# EAGLE design Horn_board_v2.2 (EAGLE 9.6.2)
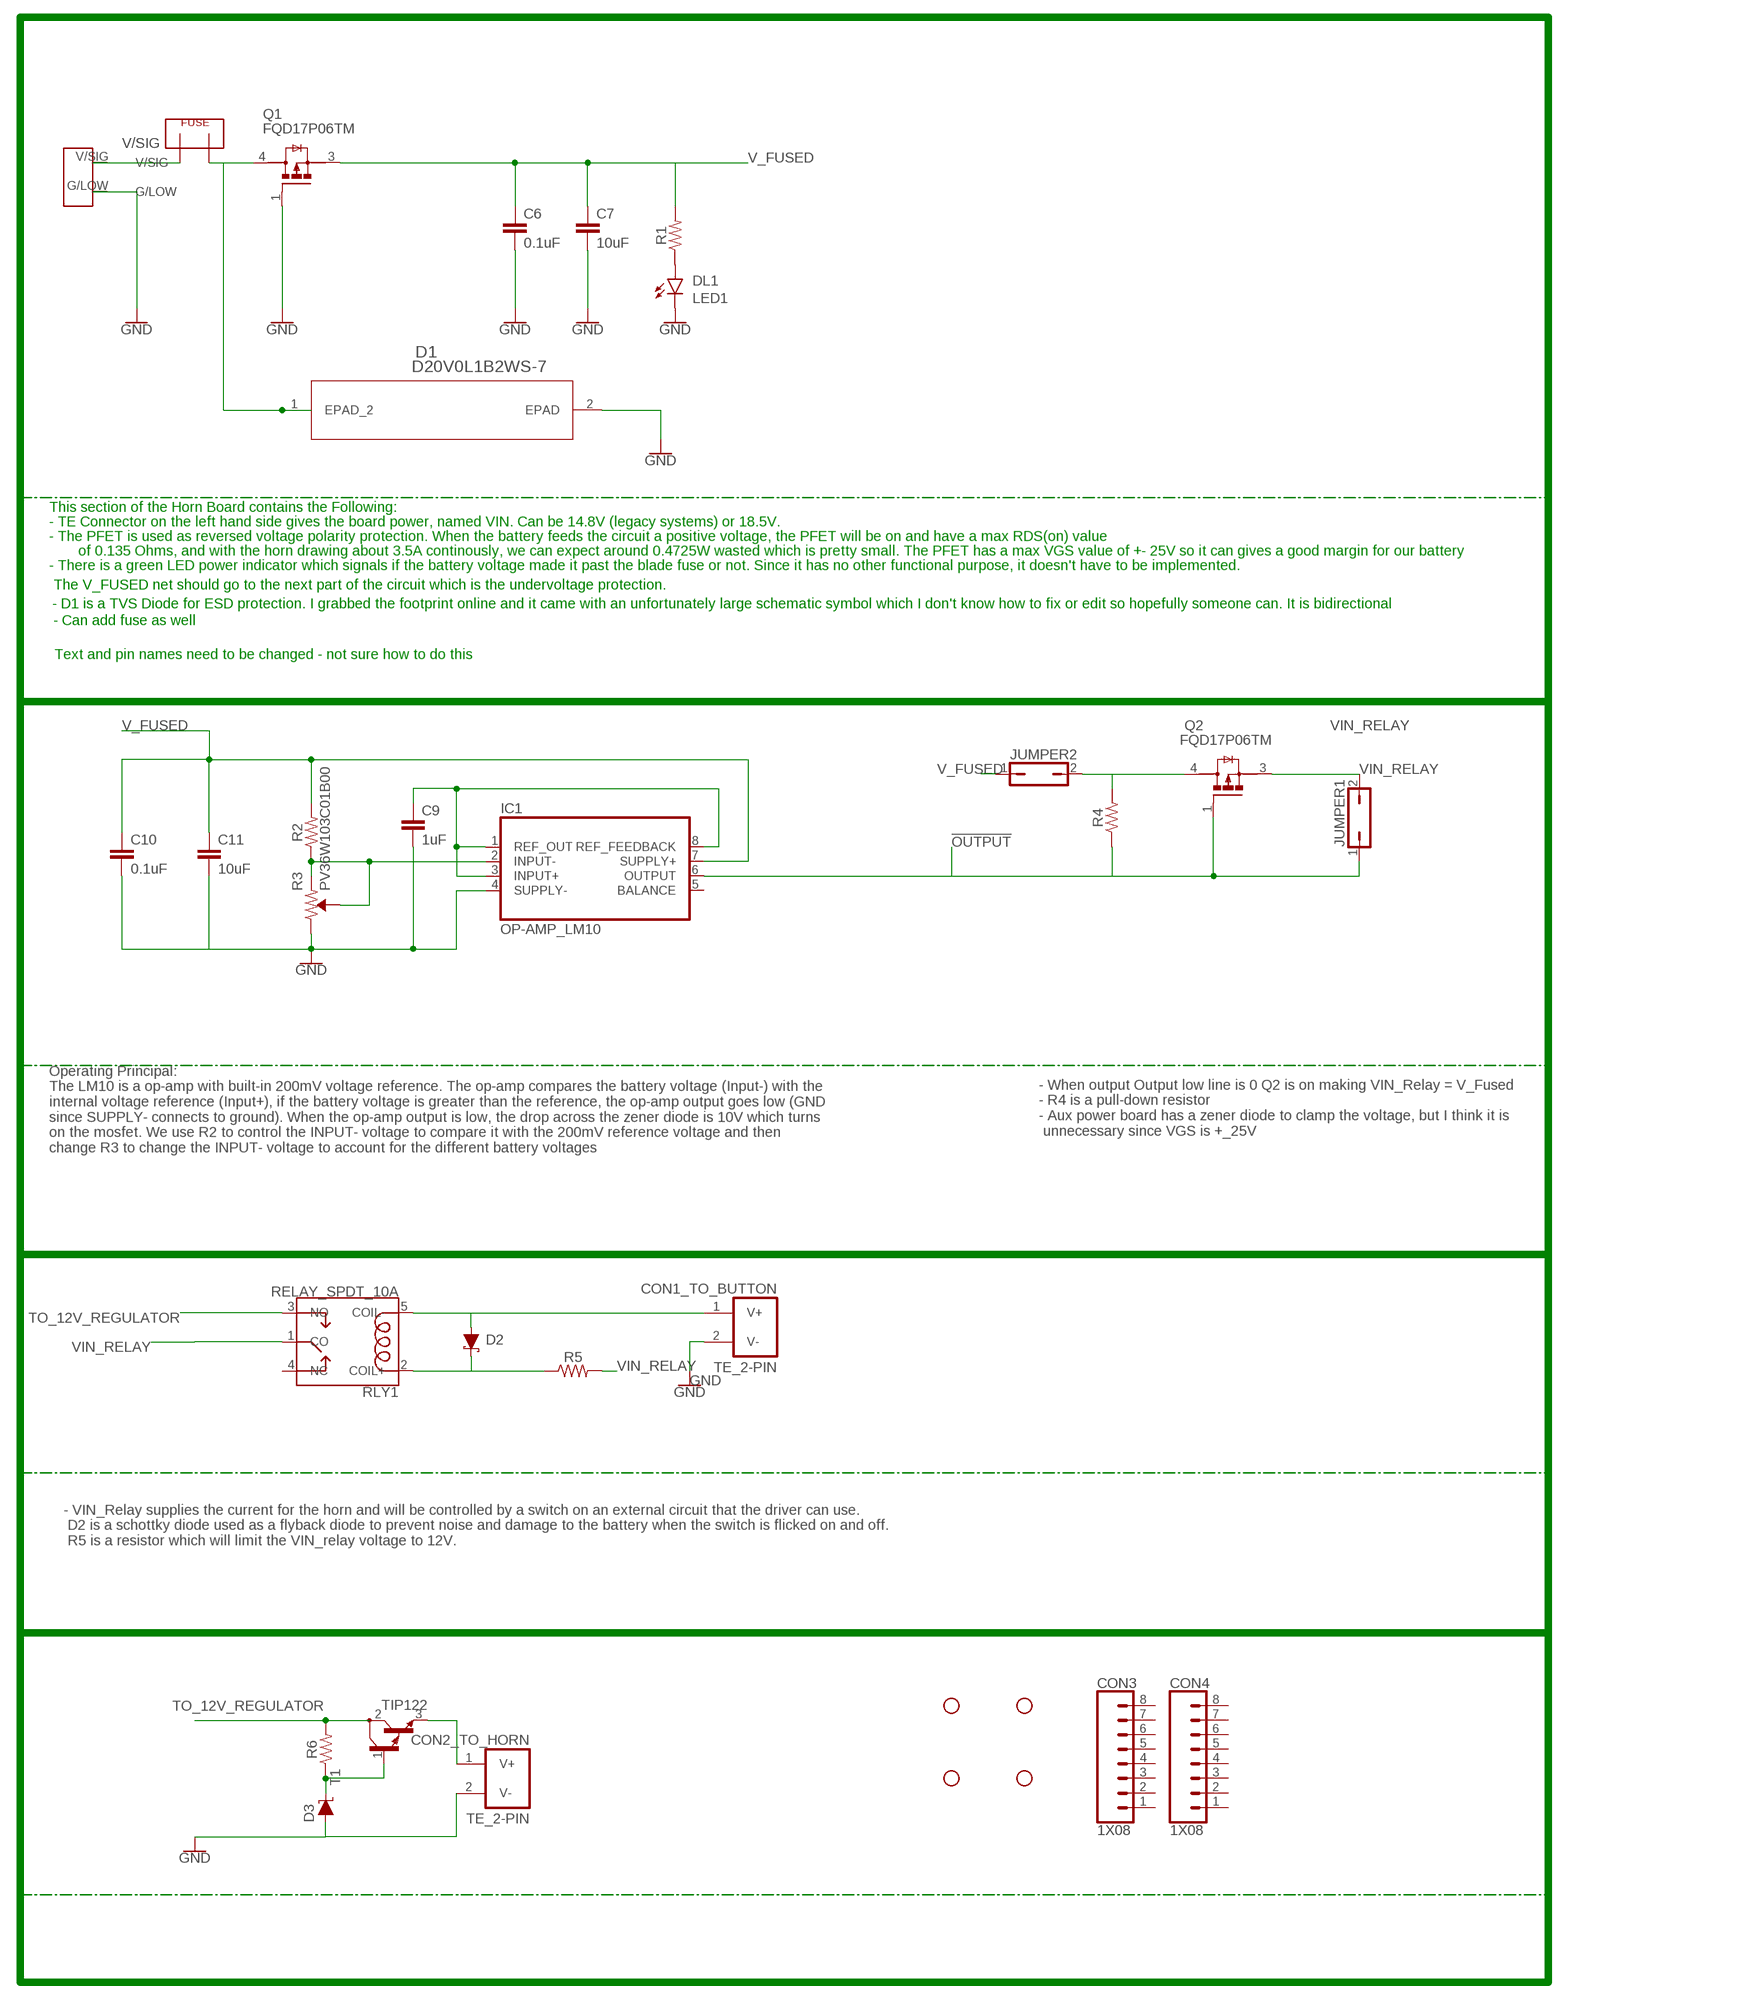
[diagram p0: schematic, sheet 1]

## Parts
C6  0.1uF  CAPACITOR_1210  [1210]
C7  10uF  CAPACITOR_1210  [1210]
C9  1uF  CAPACITOR_1210  [1210]
C10  0.1uF  CAPACITOR_1210  [1210]
C11  10uF  CAPACITOR_1210  [1210]
CON1_TO_BUTTON  TE_2-PIN  [TE_2-PIN]
CON2_TO_HORN  TE_2-PIN  [TE_2-PIN]
CON3  1X08  [1X08]
CON4  1X08  [1X08]
D1  D20V0L1B2WS-7  [SOD323_DIO]
D2  DIODE_SCHOTTKY_DO-214AA  [DO214AA]
D3  DIODE_TVS_DO-214AA  [DO214AA]
F1  FUSEMINI-BLADE  [MINI-BLADE-FUSE]
H1  STAND-OFF  [STAND-OFF]
H2  STAND-OFF  [STAND-OFF]
H3  STAND-OFF  [STAND-OFF]
H4  STAND-OFF  [STAND-OFF]
IC1  OP-AMP_LM10  [DIP08]
JUMPER1  JP1Q  [JP1]
JUMPER2  JP1Q  [JP1]
LED1  DL1  LED_0805  [0805_LED]
PWR  2_PIN_TECONNECTOR  [2_PIN_CONNECT]
Q1  FQD17P06TM  [DPAK229P990X239-4N]
Q2  FQD17P06TM  [DPAK229P990X239-4N]
R1  RESISTOR_1210  [1210]
R2  RESISTOR_1210  [1210]
R3  PV36W103C01B00  RESISTOR_TRIMPOT  [TRIMPOT]
R4  RESISTOR_1210  [1210]
R5  RESISTOR_1210  [1210]
R6  RESISTOR_1210  [1210]
RLY1  RELAY_SPDT_10A  [RELAY_SPDT_10A]
T1  TIP122  [TO220]

## Nets
!OUTPUT: IC1.6(OUTPUT) JUMPER1.1 Q2.1(G) R4.1
GND: C6.2 C7.2 C10.2 C11.2 CON1_TO_BUTTON.2(V-) CON2_TO_HORN.2(V-) D1.2(EPAD) D3.A LED1.2(C) PWR.G/LOW Q1.1(G) R3.3(CW)
N$2: C9.2 IC1.4(SUPPLY-)
N$4: RLY1.1(CO)
N$5: LED1.1(A) R1.1
N$6: IC1.2(INPUT-) R2.1 R3.1(CCW) R3.2(WIPER)
N$8: C9.1 IC1.1(REF_OUT) IC1.3(INPUT+) IC1.8(REF_FEEDBACK)
N$9: JUMPER2.2 Q2.4(D) R4.2
N$10: D2.C R5.1 RLY1.2(COIL+)
N$11: CON1_TO_BUTTON.1(V+) D2.A RLY1.5(COIL-)
N$13: D3.C R6.1 T1.1(B)
N$14: CON2_TO_HORN.1(V+) T1.3(E)
TO_12V_REGULATOR: R6.2 RLY1.3(NO) T1.2(C)
V/SIG: F1.OUT PWR.V/SIG
V_FUSED: C6.1 C7.1 C10.1 C11.1 IC1.7(SUPPLY+) JUMPER2.1 Q1.3(S) R1.2 R2.2
VIN: D1.1(EPAD_2) F1.IN Q1.4(D)
VIN_RELAY: JUMPER1.2 Q2.3(S) R5.2
Unconnected: CON3.1 CON3.2 CON3.3 CON3.4 CON3.5 CON3.6 CON3.7 CON3.8 CON4.1 CON4.2 CON4.3 CON4.4 CON4.5 CON4.6 CON4.7 CON4.8 IC1.5(BALANCE) RLY1.4(NC)

## Notes on the sheet
- This section of the Horn Board contains the Following:
- - TE Connector on the left hand side gives the board power, named VIN. Can be 14.8V (legacy systems) or 18.5V.
- - The PFET is used as reversed voltage polarity protection. When the battery feeds the circuit a positive voltage, the PFET will be on and have a max RDS(on) value
- of 0.135 Ohms, and with the horn drawing about 3.5A continously, we can expect around 0.4725W wasted which is pretty small. The PFET has a max VGS value of +- 25V so it can gives a good margin for our battery
- - There is a green LED power indicator which signals if the battery voltage made it past the blade fuse or not. Since it has no other functional purpose, it doesn't have to be implemented.
- The V_FUSED net should go to the next part of the circuit which is the undervoltage protection.
- - D1 is a TVS Diode for ESD protection. I grabbed the footprint online and it came with an unfortunately large schematic symbol which I don't know how to fix or edit so hopefully someone can. It is bidirectional
- - Can add fuse as well
- Text and pin names need to be changed - not sure how to do this
- - When output Output low line is 0 Q2 is on making VIN_Relay = V_Fused
  - R4 is a pull-down resistor 
  - Aux power board has a zener diode to clamp the voltage, but I think it is
   unnecessary since VGS is +_25V
- Operating Principal: 
  The LM10 is a op-amp with built-in 200mV voltage reference. The op-amp compares the battery voltage (Input-) with the 
  internal voltage reference (Input+), if the battery voltage is greater than the reference, the op-amp output goes low (GND 
  since SUPPLY- connects to ground). When the op-amp output is low, the drop across the zener diode is 10V which turns 
  on the mosfet. We use R2 to control the INPUT- voltage to compare it with the 200mV reference voltage and then 
  change R3 to change the INPUT- voltage to account for the different battery voltages
- - VIN_Relay supplies the current for the horn and will be controlled by a switch on an external circuit that the driver can use. 
   D2 is a schottky diode used as a flyback diode to prevent noise and damage to the battery when the switch is flicked on and off.
   R5 is a resistor which will limit the VIN_relay voltage to 12V.

## Library data of the parts
C6 C7 C9-C11 = EcoCar-Passives:CAPACITOR_1210
CON1_TO_BUTTON CON2_TO_HORN = EcoCar-Connectors:TE_2-PIN: 2 Pin TE Mini-Universal MATE-N-LOK - Use for signals and power connections Part Number: 1-770966-0 Digikey Part Number: A32471-ND Matching Plug: A25587-ND Matching Crimps: A100828CT-ND
CON3 CON4 = EcoCar-Connectors-2.54mm:1X08: 2.54mm (0.1") Header
D1 = TVS Diode - 20V:D20V0L1B2WS-7: TVS Diode 20V - Bidirectional; BUILT_BY: EMA_UL_Team; MANUFACTURER_PART_NUMBER: D20V0L1B2WS-7; SOURCELIBRARY: DIODESINC_2_2015-08-18; VENDOR: Diodes Inc
D2 = EcoCar-Discrete-Semiconductors:DIODE_SCHOTTKY_DO-214AA
D3 = EcoCar-Fuses-Protection:DIODE_TVS_DO-214AA
F1 = Fuse:FUSE
H1-H4 = EcoCar-Miscellaneous:STAND-OFF: Stand Off Drill holes for mechanically mounting via screws, standoffs, etc. Note: Use the keepout ring to avoid running the screw head into surrounding components. Variant Overviews STAND-OFF - Mechanical footprint for a #4 phillips button head screw. STAND-OFF-TIGHT - Mechanical footprint for a #4 phillips button head screw, Example SparkFun Products Screw - Phillips Head (1/4", 4-40, 10 pack) <https://www.sparkfun.com/products/10453> (PRT-10453) Screw - Phillips Head (1/2", 4-40, 10 pack) <https://www.sparkfun.com/products/10452> (PRT-10452) Screw - Phillips Head (3/4", 4-40, 10 pack) <https://www.sparkfun.com/products/10451> (PRT-10451) Screw - Phillips Head (1", 4-40, 10 pack) <https://www.sparkfun.com/products/10450> (PRT-10450)
IC1 = EcoCar-Integrated-Circuits:OP-AMP_LM10: Op-Amp with Internal Voltage Reference Manufacturer: Texas Instruments Part Number: LM10CN/NOPB Digikey Part Number: LM10CN/NOPB-ND
JUMPER1 JUMPER2 = jumper:JP1Q: JUMPER
LED1 = EcoCar-Discrete-Semiconductors:LED_0805
PWR = TE 2-pin connector:2_PIN_TECONNECTOR: 2-pin connector for high power connections on board
Q1 Q2 = PFET - Reverse Polarity Protection:FQD17P06TM: Transistor: P-MOSFET; unipolar; 60V; 7.6A; 44W; DPAK; QFET®; MANUFACTURER: ON Semiconductor; PARTREV: C3; SNAPEDA_PACKAGE_ID: 35066; STANDARD: IPC7351B
R1 R2 R4-R6 = EcoCar-Passives:RESISTOR_1210
R3 = EcoCar-Passives:RESISTOR_TRIMPOT: Bourns Trimpot Example Part: 10k trimpot Manufacturer: Bourns Part Number: PV36W103C01B00 Digikey Part Number: 490-2875-ND
RLY1 = EcoCar-Electromechanical:RELAY_SPDT_10A: 10A SPDT Relay Manufacturer: Omron Part Number: G5LE-1-VDDC12 Digikey Part Number: Z3672-ND Ratings: 12VDC coil voltage 33.3mA coil current 250VAC/125VDC switching voltage 10A contact rating
T1 = transistor:TIP122: NPN BIPOLAR DARLINGTON TRANSISTOR

## Board
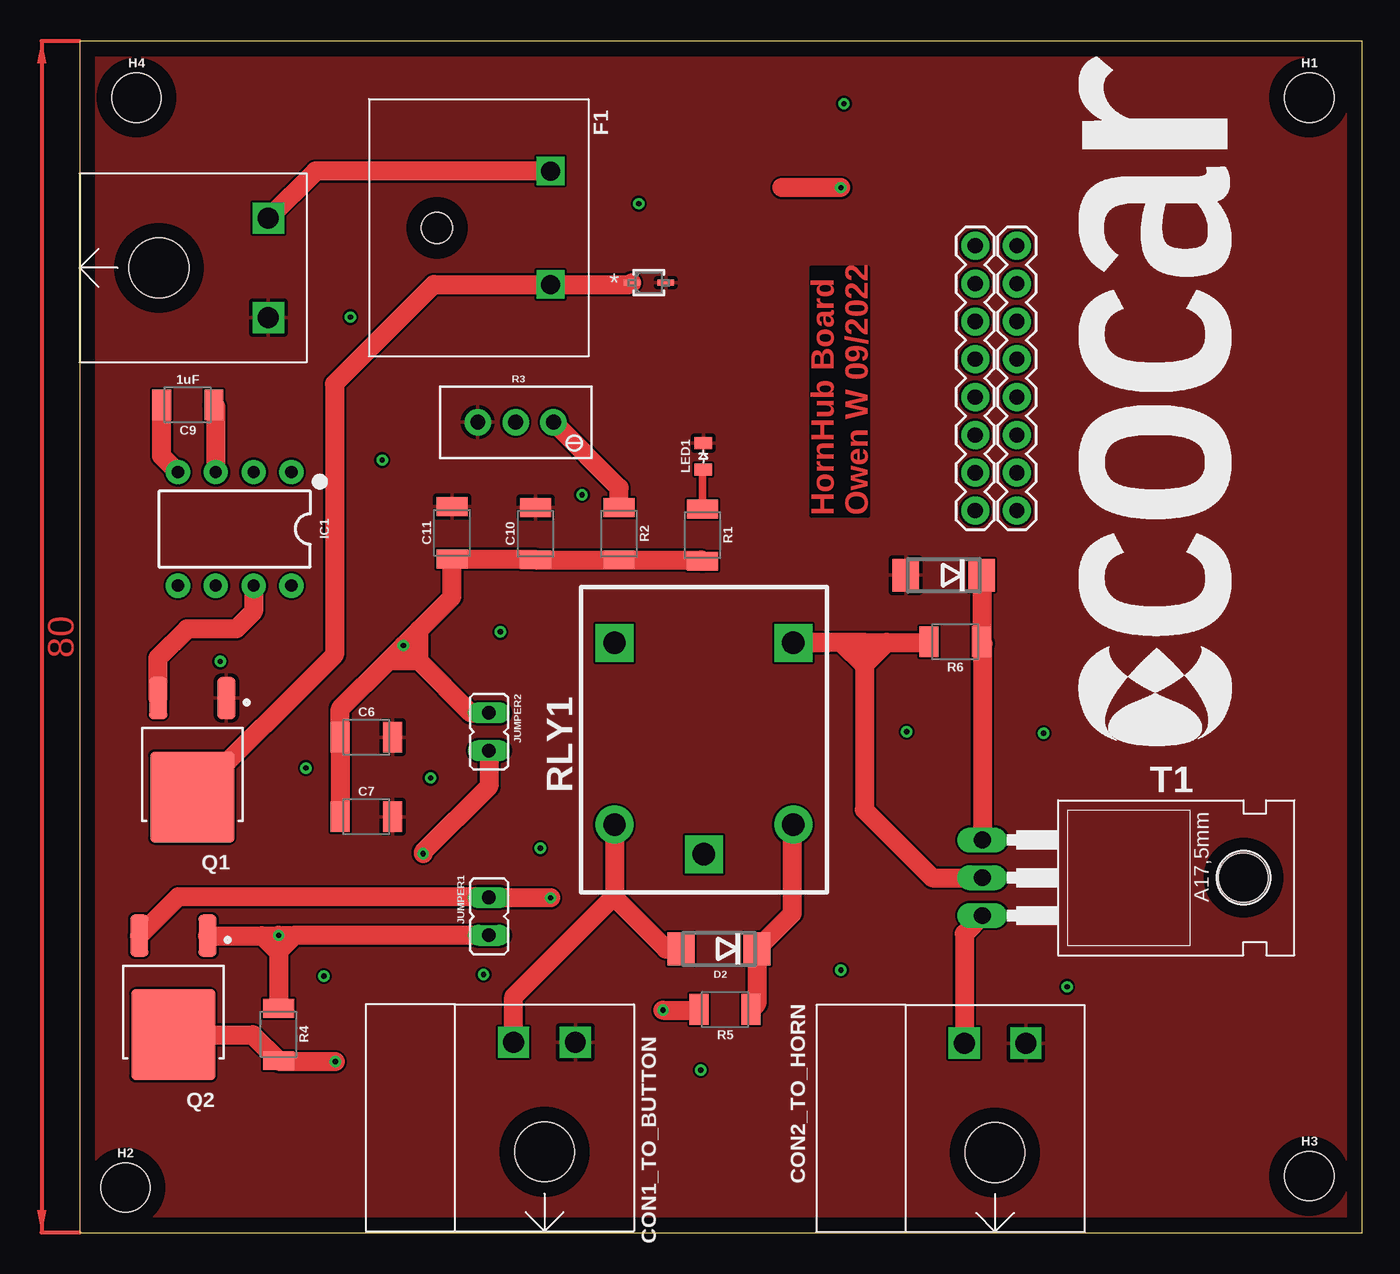
[diagram p1: board, top side]
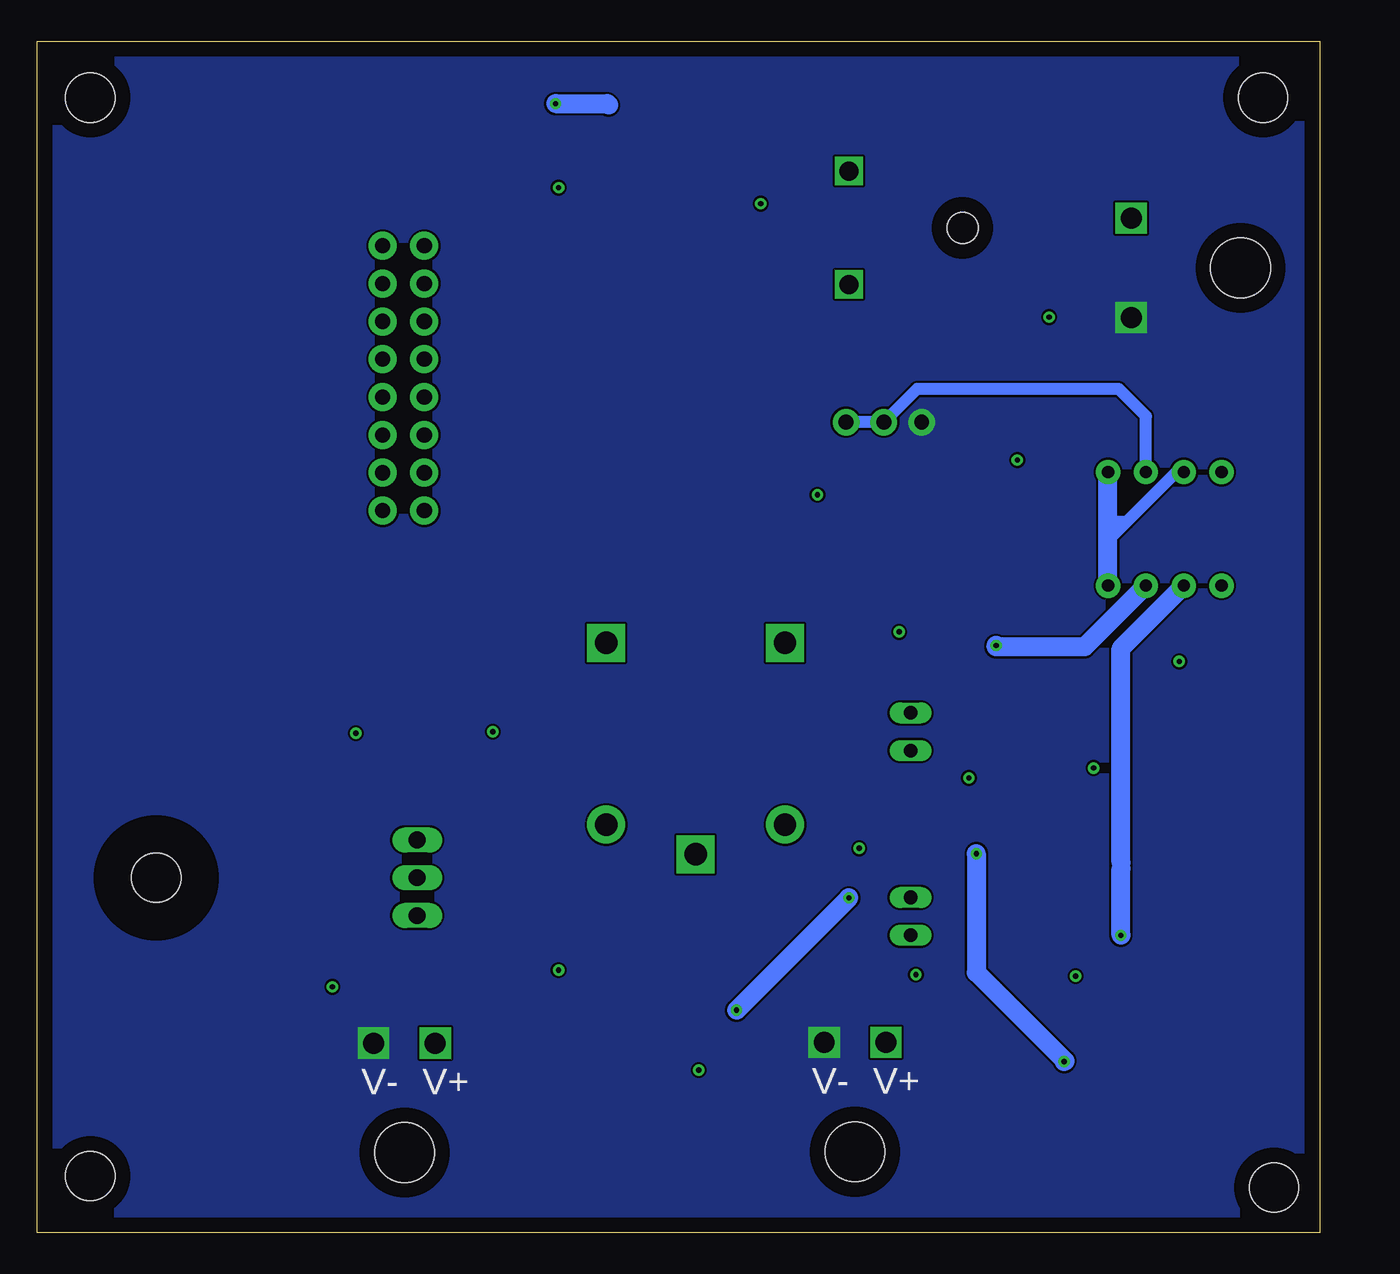
[diagram p2: board, bottom side, seen from below]

Size 86.11 x 80 mm. Coordinates in mm from the lower left corner, seen from the top.
Outline: 0,0 86.11,0 86.11,80 0,80 0,0
Copper layers (1*16): Top 0.035mm / dielectric 1.5mm / Bottom 0.035mm
Design rules "default": minimum track width 6mil, minimum drill 0.35mm, track to track 6mil, track to pad 6mil, pad to pad 6mil, via to via 6mil, smd to smd 6mil, copper to edge 40mil, drill to drill 6mil, minimum pad ring 10mil, minimum via ring 8mil, stop-mask expansion 4mil, vias tented up to drill 0mil, thermal gap 10mil

### Footprints (pad centres in the part's own frame; a part is rotated, then mirrored left to right if it is on the bottom)
1210 = smd 1.27 x 2.06: 1 -1.755,0; 2 1.755,0
TE_2-PIN = drill 1.4 square: 1 -2.07,12.67; 2 2.07,12.67 | hole 4: 0,5.33
1X08 = drill 1.016 pad 1.88: 1 0,0; 2 2.54,0; 3 5.08,0; 4 7.62,0; 5 10.16,0; 6 12.7,0; 7 15.24,0; 8 17.78,0
SOD323_DIO = smd 1.111 x 0.401: 1 -1.15,0; 2 1.15,0
DO214AA = smd 1.8 x 2.2: A 2.55,0; C -2.55,0
MINI-BLADE-FUSE = drill 1.27 square: IN 3.81,7.62; OUT -3.81,7.62 | hole 2.083: 0,0
STAND-OFF = hole 3.302: 0,0
DIP08 = drill 0.813 pad 1.626: 1 -3.81,-3.81; 2 -1.27,-3.81; 3 1.27,-3.81; 4 3.81,-3.81; 5 3.81,3.81; 6 1.27,3.81; 7 -1.27,3.81; 8 -3.81,3.81
JP1 = drill 0.914 long: 1 0,-1.27; 2 0,1.27
0805_LED = smd 0.8 x 1.2: 1 -0.9,0; 2 0.9,0
2_PIN_CONNECT = drill 1.4 square: G/LOW 3.34,12.67; V/SIG -3.34,12.67 | hole 4: 0,5.33
DPAK229P990X239-4N = smd 1.22 x 2.83: 1 -2.29,-4.14; 3 2.29,-4.14 | smd 5.63 x 6.1: 4 0,2.51
TRIMPOT = drill 1 pad 1.778: 1 5.08,0; 2 2.54,0; 3 0,0
RELAY_SPDT_10A = drill 1.5 pad 2.55 square: 1 0,0; 3 14.2,-6; 4 14.2,6 | drill 1.5 pad 2.55: 2 2,-6; 5 2,6
TO220 = drill 1.118 long: 1 -2.54,-6.35; 2 0,-6.35; 3 2.54,-6.35 | hole 3.302: 0,11.176

### Placement (x,y rotation side)
C6  19.25,33.26 0 top
C7  19.25,27.93 0 top
C9  7.26,55.58 180 top
C10  30.61,46.93 90 top
C11  25,46.98 90 top
CON1_TO_BUTTON  31.21,0.1 0 top
CON2_TO_HORN  61.46,0.05 0 top
CON3  62.92,48.47 90 top
CON4  60.13,48.47 90 top
D1  38.21,63.77 0 top
D2  42.93,19.05 180 top
D3  58.01,44.14 180 top
F1  24,67.46 270 top
H1  82.55,76.2 0 top
H2  3.07,3.02 0 top
H3  82.55,3.81 0 top
H4  3.81,76.2 0 top
IC1  10.41,47.24 180 top
JUMPER1  27.48,21.23 0 top
JUMPER2  27.48,33.63 180 top
LED1  41.87,52.12 90 top
PWR  0,64.77 270 top
Q1  7.57,31.75 180 top
Q2  6.3,15.8 180 top
R1  41.82,46.83 270 top
R2  36.22,46.93 270 top
R3  26.73,54.41 0 top
R4  13.36,13.31 270 top
R5  43.33,14.99 180 top
R6  58.78,39.67 180 top
RLY1  41.91,25.4 90 top
T1  66.95,23.83 270 top
U$1  [ECOCAR_LOGO_2018]  77.37,32.66 90 top

### Tracks (layer width: path | path; a pad name or v marks a point on that pad's centre or on a via)
!OUTPUT  (via drill 0.35)
  Top 1.27: v13.36,19.96 13.36,18.85 | 13.36,18.85 R4.1 | Q2.1 12.24,19.94 | 12.24,19.94 13.34,19.94 v13.36,19.96 | v13.36,19.96 14.45,19.96 | JUMPER1.1 14.45,19.96 | 12.24,19.94 13.34,18.85 | 13.34,18.85 13.36,18.85 | 14.45,19.96 13.34,18.85
  Bottom 0.813: 13.36,24.42 13.36,24.84
  Bottom 1.27: v13.36,19.96 13.36,24.42 | 13.36,24.84 13.36,39.22 IC1.6
GND
  pour Top: -2.54,86.36 123.19,86.36 135.84,73.71 135.84,5.03 124.46,-6.35 -8.89,-6.35 -10.16,-5.08 -10.16,78.74
  pour Bottom (no thermals): 28.04,82.09 89.51,82.09 94.39,77.22 94.39,2.13 88.6,-3.66 -3.05,-3.66 -4.27,-2.44 -4.27,82.09 27.74,82.09 27.74,82.04 27.64,81.94 28.6,81.94 28.75,81.79 30.58,81.79 30.84,82.04
N$1  (via drill 0.35)
  Bottom 1.27: v51.31,75.79 47.85,75.79 47.75,75.69
N$2
  Top 1.27: IC1.4 5.51,52.15 C9.2
N$3  (via drill 0.35)
  other vias: 37.54,69.09
N$5
  Top 0.508: LED1.1 41.82,51.17 R1.1
N$6
  Top 0.508: R2.1 36.17,48.63
  Top 1.27: R2.1 36.22,50.01 R3.1
  Bottom 0.813: IC1.2 11.68,54.81 13.51,56.64 27.04,56.64 R3.2 R3.1
N$7  (via drill 0.35)
  other vias: 18.19,61.47
N$8
  Top 1.27: C9.1 9.14,55.45 IC1.3
  Bottom 0.508: 14.07,48.97 14.07,47.75 14.07,46.63
  Bottom 0.813: 13.01,47.7 9.65,51.05 IC1.3 | 14.07,47.75 13.01,47.75 13.01,47.7 | IC1.1 14.22,49.12 14.07,48.97 14.07,46.63 | IC1.8 14.22,46.48 14.07,46.63 | 13.01,47.7 14.07,46.63
  Bottom 1.27: IC1.8 IC1.1
N$9  (via drill 0.35)
  Top 1.27: v17.17,11.48 13.43,11.48 R4.2 11.63,13.29 Q2.4 | v23.06,25.45 23.06,25.55 27.48,29.97 JUMPER2.2
  Bottom 1.27: v17.17,11.48 17.12,11.53 23.06,17.47 v23.06,25.45
N$10
  Top 0.508: 45.3,15.2 R5.1
  Top 1.27: RLY1.2 47.85,27.34 47.85,21.43 D2.C 45.48,15.37 45.3,15.2
N$11
  Top 0.61: D2.A 40.38,18.35
  Top 1.27: CON1_TO_BUTTON.1 29.14,15.83 35.81,22.5 35.91,22.5 | 40.33,19.1 D2.A 39.36,19.05 35.91,22.5 | RLY1.5 35.91,22.5
N$12  (via drill 0.35)
  Top 1.27: v51.11,70.15 47.14,70.15
N$13
  Top 1.27: T1.1 60.6,39.7 60.58,39.73 R6.1 | R6.1 60.67,39.54 | D3.C 60.56,39.71 R6.1
N$14
  Top 1.27: T1.3 59.39,20.07 CON2_TO_HORN.1
N$15  (via drill 0.35)
  other vias: 20.32,51.87
N$16  (via drill 0.35)
  other vias: 33.73,49.53
N$17  (via drill 0.35)
  other vias: 28.24,40.34
N$18  (via drill 0.35)
  other vias: 9.45,38.35
N$19  (via drill 0.35)
  other vias: 15.19,31.19
N$20  (via drill 0.35)
  other vias: 23.57,30.53
N$21  (via drill 0.35)
  other vias: 30.94,25.81
N$22  (via drill 0.35)
  other vias: 27.13,17.32
N$23  (via drill 0.35)
  other vias: 16.41,17.22
N$24  (via drill 0.35)
  other vias: 41.71,10.92
N$25  (via drill 0.35)
  other vias: 51.1,17.63
N$26  (via drill 0.35)
  other vias: 66.29,16.51
N$27  (via drill 0.35)
  other vias: 64.72,33.53
N$28  (via drill 0.35)
  other vias: 55.52,33.63
TO_12V_REGULATOR
  Top 1.27: 50.23,39.6 RLY1.3 47.93,39.62 51.16,39.62 | 52.68,38.1 52.68,28.39 57.24,23.82 T1.2 | 52.68,39.62 52.68,38.1 | 52.68,39.62 54.2,39.62 | 54.2,39.62 56.97,39.62 R6.2 | 52.68,39.62 51.16,39.62 | 51.16,39.62 52.68,38.1 | 52.68,38.1 54.2,39.62
V/SIG
  Top 1.27: PWR.V/SIG 15.83,71.27 F1.OUT
V_FUSED  (via drill 0.35)
  Top 1.27: R1.2 41.72,45.17 R2.2 C10.1 30.56,45.22 C11.1 25,42.68 22.78,40.46 | v21.74,39.42 22.78,38.38 | 22.78,38.38 26.26,34.9 JUMPER2.1 | 20.7,38.38 17.5,35.18 C6.1 C7.1 | 20.7,38.38 v21.74,39.42 | v21.74,39.42 22.78,40.46 | 22.78,38.38 20.7,38.38 | 22.78,38.38 22.78,40.46 | Q1.3 5.28,38.6 7.21,40.54 10.52,40.54 11.68,41.71 IC1.7
  Bottom 1.27: v21.74,39.42 21.74,39.32 15.8,39.32 IC1.7
VIN
  Top 1.27: D1.1 36.94,63.65 F1.IN 23.77,63.65 17.12,57 17.12,38.79 Q1.4
VIN_RELAY  (via drill 0.35)
  Top 0.508: 41.49,15.08 R5.2
  Top 1.27: Q2.3 6.63,22.55 27.43,22.55 JUMPER1.2 27.51,22.48 v31.62,22.48 | v39.17,14.93 41.35,14.93 41.49,15.08
  Bottom 1.27: v31.62,22.48 v39.17,14.93
(copper drawn outside any net)
  shapes: Top area x1

### Text on the board
Top: HornHub Board / Owen W 09/2022